# EAGLE design IR-Demodulator-Transceiver-v1c (EAGLE 8.6.0)
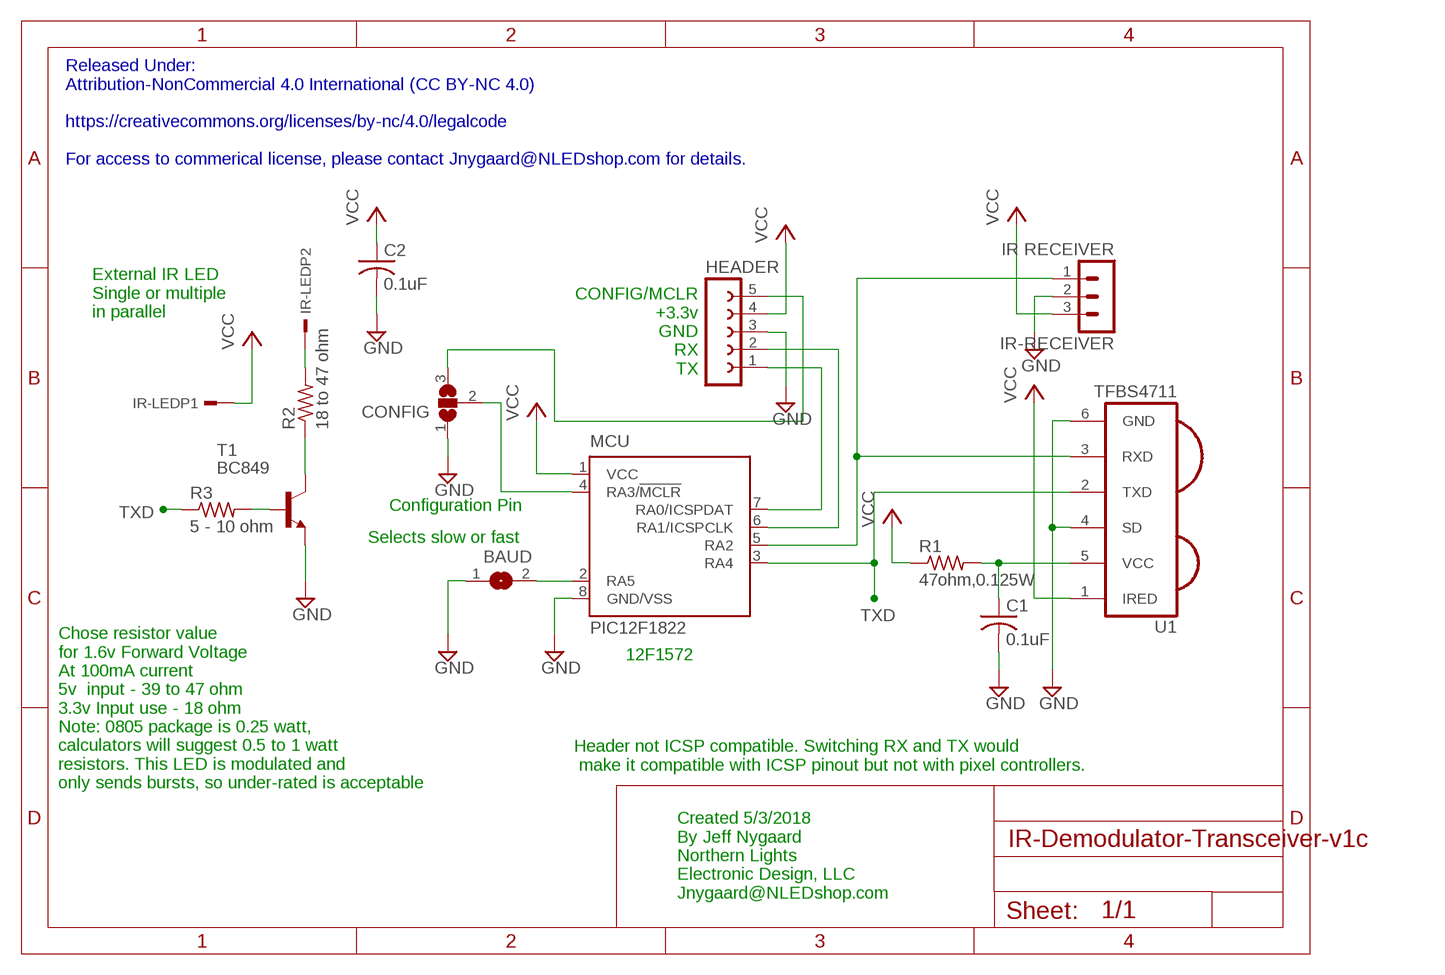
[diagram p0: schematic, sheet 1]

## Parts
BAUD  SJ  [SJ]
C1  0.1uF  C-USC0805  [C0805]
C2  0.1uF  C-USC0805  [C0805]
CONFIG  SJ2W  [SJ_2]
HEADER  FE05-1  [FE05-1]
IR-LED  HEADER-2X1  [HEADER-2X1]
IR-RECEIVER  IR RECEIVER  MA03-11  [MA03-1]
MCU  PIC12F1822  [SOIC-8]
R1  47ohm,0.125W  R-US_R0805  [R0805]
R2  18 to 47 ohm  R-US_R0805  [R0805]
R3  5 - 10 ohm  R-US_R0603  [R0603]
T1  BC849  [SOT23]
U1  TFBS4711  [TFBS4711]

## Nets
GND: BAUD.1 C1.2 C2.2 CONFIG.1 HEADER.3 IR-RECEIVER.2 MCU.8(GND/VSS) T1.2(E) U1.4(SD) U1.6(GND)
IRRX: IR-RECEIVER.1 MCU.5(RA2) U1.3(RXD)
N$1: R3.2 T1.1(B)
N$2: BAUD.2 MCU.2(RA5)
N$3: C1.1 R1.2 U1.5(VCC)
N$4: CONFIG.3 HEADER.5
N$5: HEADER.1 MCU.7(RA0/ICSPDAT)
N$6: HEADER.2 MCU.6(RA1/ICSPCLK)
N$7: CONFIG.2 MCU.4(RA3/!MCLR)
N$8: IR-LED.2 R2.2
N$9: R2.1 T1.3(C)
TXD: MCU.3(RA4) R3.1 U1.2(TXD)
VCC: C2.1 HEADER.4 IR-LED.1 IR-RECEIVER.3 MCU.1(VCC) R1.1 U1.1(IRED)

## Notes on the sheet
- Released Under:
  Attribution-NonCommercial 4.0 International (CC BY-NC 4.0)
  
  https://creativecommons.org/licenses/by-nc/4.0/legalcode
  
  For access to commerical license, please contact Jnygaard@NLEDshop.com for details.
- External IR LED
  Single or multiple
  in parallel
- CONFIG/MCLR
  +3.3v
  GND
  RX
  TX
- Configuration Pin
- Selects slow or fast
- 12F1572
- Header not ICSP compatible. Switching RX and TX would
   make it compatible with ICSP pinout but not with pixel controllers.
- Chose resistor value
  for 1.6v Forward Voltage
  At 100mA current
  5v  input - 39 to 47 ohm
  3.3v Input use - 18 ohm
  Note: 0805 package is 0.25 watt,
  calculators will suggest 0.5 to 1 watt
  resistors. This LED is modulated and
  only sends bursts, so under-rated is acceptable
- Created 5/3/2018
  By Jeff Nygaard
  Northern Lights
  Electronic Design, LLC
  Jnygaard@NLEDshop.com

## Library data of the parts
BAUD = jumper:SJ: SMD solder JUMPER
C1 C2 = rcl:C-US: CAPACITOR, American symbol
CONFIG = jumper:SJ2W: SMD solder JUMPER
HEADER = NLED-connectors:FE05-1: FEMALE HEADER; OC_FARNELL: unknown; OC_NEWARK: unknown
IR-LED = NLED-connectors:HEADER-2X1
IR-RECEIVER = NLED-connectors:MA03-1: PIN HEADER; OC_FARNELL: unknown; OC_NEWARK: unknown
MCU = NLED-microcontrollers:PIC12F1822: 8-Pin FLASH-Based 8-Bit CMOS Microcontroller Precision Internal 4 MHz oscillator factory calibrated to ±1% Low Power Features: Standby Current: - 1 nA @ 2.0V, typical Operating Current: - 8.5µA @ 32 kHz, 2.0V, typical - 100µA @ 1 MHz, 2.0V, typical Watchdog Timer Current: - 300 nA @ 2.0V, typical Timer1 oscillator current: - 4µA @ 32 kHz, 2.0V, typical Analog-to-Digital Converter module: - 10-bit resolution - Programmable 4-channel input - Voltage reference input Source: http://www.microchip.com .. 41190E.pdf
R1-R3 = rcl:R-US_: RESISTOR, American symbol; SPICEPREFIX: R
T1 = transistor:BC849: NPN TRANSISTOR
U1 = vishay:TFBS4711: IRDA TRANSCIEVER MODULE

## Board
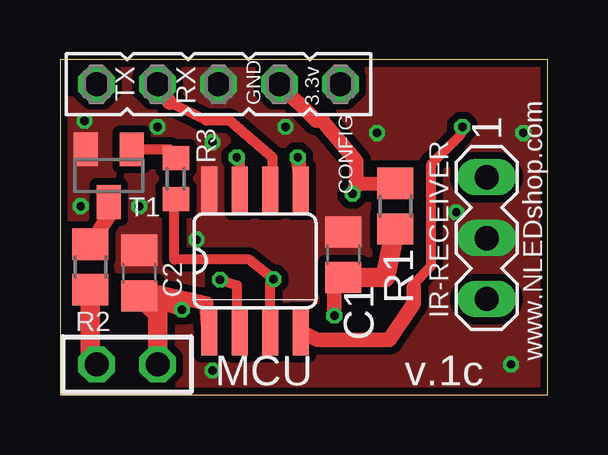
[diagram p1: board, top side]
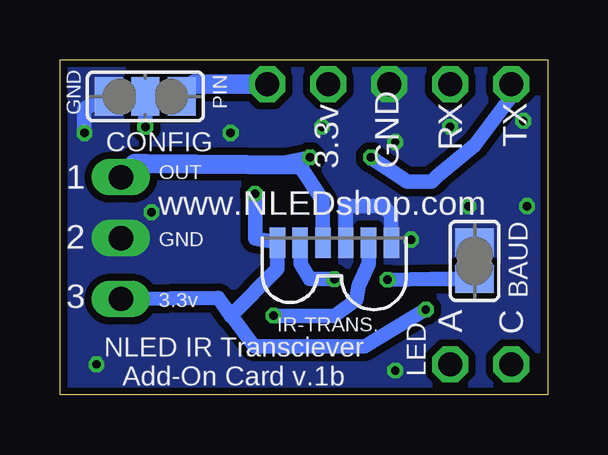
[diagram p2: board, bottom side, seen from below]

Size 20.32 x 13.97 mm. Coordinates in mm from the lower left corner, seen from the top.
Outline: 0,0 20.32,0 20.32,13.97 0,13.97 0,0
Copper layers (1*16): Top 0.035mm / dielectric 1.5mm / Bottom 0.035mm
Design rules "SeeedStudio_2layer_DRU_no_angle_20140221 *": minimum track width 6mil, minimum drill 12mil, track to track 12mil, track to pad 20mil, pad to pad 6mil, via to via 6mil, smd to smd 0mil, copper to edge 12mil, drill to drill 12mil, minimum pad ring 10mil, minimum via ring 6mil, stop-mask expansion 2mil, vias tented up to drill 100mil, thermal gap 10mil

### Footprints (pad centres in the part's own frame; a part is rotated, then mirrored left to right if it is on the bottom)
SJ = smd 1.168 x 1.6: 1 -0.762,0; 2 0.762,0
C0805 = smd 1.3 x 1.5: 1 -0.95,0; 2 0.95,0
SJ_2 = smd 1.168 x 1.6: 1 -1.524,0; 2 0,0; 3 1.524,0
FE05-1 = drill 1 octagon: 1 -5.08,0; 2 -2.54,0; 3 0,0; 4 2.54,0; 5 5.08,0
HEADER-2X1 = drill 1 pad 1.5 octagon: 1 1.27,0; 2 -1.27,0
MA03-1 = drill 1.016 long: 1 -2.54,0; 2 0,0; 3 2.54,0
SOIC-8 = smd 0.66 x 1.93: 1 -1.905,-2.972; 2 -0.635,-2.972; 3 0.635,-2.972; 4 1.905,-2.972; 5 1.905,2.972; 6 0.635,2.972; 7 -0.635,2.972; 8 -1.905,2.972
R0805 = smd 1.3 x 1.5: 1 -0.95,0; 2 0.95,0
R0603 = smd 1 x 1.1: 1 -0.85,0; 2 0.85,0
SOT23 = smd 1 x 1.4: 1 -0.95,-1.1; 2 0.95,-1.1; 3 0,1.1
TFBS4711 = smd 1.27 x 0.64: 1 0,2.375; 2 0,1.425; 3 0,0.475; 4 0,-0.475; 5 0,-1.425; 6 0,-2.375

### Placement (x,y rotation side)
BAUD  3.05,5.59 270 bottom
C1  11.81,5.84 90 top
C2  3.3,5.08 90 top
CONFIG  16.76,12.45 0 bottom
HEADER  6.6,12.95 0 top
IR-LED  2.79,1.27 0 top
IR-RECEIVER  17.78,6.54 270 top
MCU  8.13,5.59 0 top
R1  13.97,7.87 270 top
R2  1.27,5.33 270 top
R3  4.83,9.02 90 top
T1  2.03,9.14 180 top
U1  8.89,6.35 90 bottom

### Tracks (layer width: path | path; a pad name or v marks a point on that pad's centre or on a via)
GND  (via drill 0.35)
  Top 0.61: C1.2 11.43,6.92
  Bottom 0.61: U1.4 8.41,7.87 7.62,7.87 6.86,7.87 6.51,7.53 U1.6 | CONFIG.1 19.3,11.94 v19.3,10.92
  other vias: 13.21,10.92 3.3,7.87 1.02,11.43 9.4,11.18 18.8,1.27 0.86,7.87 5.69,6.48 6.35,10.54 16.51,7.62 6.35,1.02 4.06,11.18
  pour Top (no thermals): 0,0 0,13.97 20.32,13.97 20.32,0
  pour Bottom (no thermals): 0,0 0,13.97 20.32,13.97 20.32,0
IRRX  (via drill 0.35)
  Top 0.61: MCU.5 10.03,9.02 v9.91,9.91
  Bottom 0.61: v9.91,9.91 10.86,9.72 10.35,9.59 9.37,8.1 U1.3
  Bottom 0.813: 10.35,9.59 16.76,9.65 17.21,9.65 IR-RECEIVER.1
N$1
  Top 0.406: T1.1 4.58,10.24 R3.2
N$2  (via drill 0.35)
  Top 0.406: v6.67,4.8 7.37,4.57 7.37,3.12 MCU.2
  Bottom 0.61: v6.67,4.8 4.83,4.83 4.32,4.83 BAUD.2
N$3  (via drill 0.35)
  Top 0.61: C1.1 11.43,4.76 v11.43,3.3
  Top 0.813: C1.1 13.55,4.89 R1.2
  Bottom 0.61: U1.5 7.46,5.49 7.87,4.57 7.97,3.96 8.89,3.3 v11.43,3.3
N$4
  Bottom 0.61: CONFIG.3 14.73,12.95
  Bottom 0.813: 14.73,12.95 HEADER.5
N$5  (via drill 0.35)
  Top 0.406: v7.37,9.91 7.49,9.78 MCU.7
  Bottom 0.61: v7.37,9.91 5.84,8.89 4.83,8.89 4.57,9.14 3.05,10.41 1.52,12.45 HEADER.1
N$6
  Top 0.406: MCU.6 8.86,8.35 8.86,9.9 7.08,11.43 6.1,11.43 4.57,12.19
  Top 0.61: 4.57,12.19 HEADER.2
N$7  (via drill 0.35)
  Top 0.406: v16.76,11.18 16.65,10.81 16.41,10.55 15.46,9.6 15.46,5.36 14.73,4.63 14.73,4.49
  Top 0.61: MCU.4 10.73,2.29 11.43,2.29 13.72,2.29 14.73,3.81 14.73,4.49
  Bottom 0.61: CONFIG.2 v16.76,11.18
N$8
  Top 0.813: IR-LED.2 1.27,1.52 R2.2
N$9
  Top 0.61: R2.1 2.03,7.45 T1.3
TXD  (via drill 0.35)
  Top 0.406: MCU.3 8.76,4.7 v8.89,4.83 7.87,5.64 4.76,5.64 4.76,8.1 R3.1
  Bottom 0.61: U1.2 10.29,6.33 10.29,5.46 9.91,4.83 v8.89,4.83
VCC  (via drill 0.35)
  Top 0.406: 4.06,3.77 3.87,3.97
  Top 0.61: 12.34,8.79 v12.19,8.38 | 12.34,8.79 R1.1 | HEADER.4 10.67,11.43 10.92,11.43 12.34,9.75 12.34,8.79 | 3.59,4.1 C2.1 | 3.59,4.1 3.88,4.32 6.1,3.81 6.16,2.99 MCU.1 | v5.08,3.56 3.87,3.97 3.59,4.06 3.59,4.1
  Top 0.813: C2.1 4.06,3.37 IR-LED.1
  Bottom 0.61: 13.72,4.03 13.21,3.3 11.27,5.25 U1.1 12.19,6.51 v12.19,8.38 | 13.72,4.03 IR-RECEIVER.3 | v5.08,3.56 7.62,2.03 12.22,2.03 13.72,4.03

### Text on the board
tNames: TX | RX | GND | 3.3v | CONFIG | www.NLEDshop.com | v.1c
bNames: TX | RX | 3.3v | PIN | GND | GND | OUT | www.NLEDshop.com | GND | C | A | 3.3v | 1 / 2 / 3 | IR-TRANS. | LED | NLED IR Transciever / Add-On Card v.1b